# Altium schematic sheet AlarmRelay.SchDoc
size A3; SheetNumber: 6; SheetTotal: 11
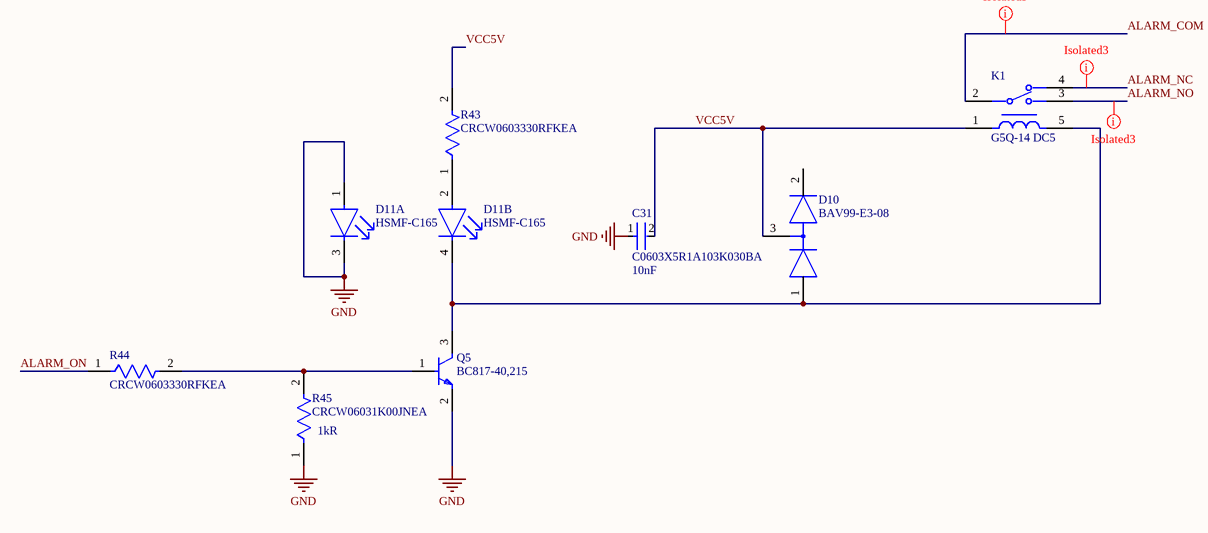
[diagram p0: AlarmRelay.SchDoc]

## Parts
C31  C0603X5R1A103K030BA  Capacitance: 10nF  [FP-C0603-030-0_03-MFG]
D10  BAV99-E3-08  [FP-6_541-5014_01-4-MFG]
D11  HSMF-C165  [FP-HSMF-C165-MFG]  (parts A,B of 2)
K1  G5Q-14 DC5  [FP-G5Q-14_DC5-MFG]
Q5  BC817-40,215  [FP-SOT23-MFG]
R43  CRCW0603330RFKEA  [FP-CRCW0603-e3-MFG]
R44  CRCW0603330RFKEA  [FP-CRCW0603-e3-MFG]
R45  CRCW06031K00JNEA  Resistance: 1kR  [FP-CRCW0603-e3-IPC_C]

## Nets
GND: C31.1 D11.1(GREEN_A) D11.3(GREEN_C) Q5.2(E) R45.1
ALARM_COM: K1.2
ALARM_NC: K1.4
ALARM_NO: K1.3
ALARM_ON: R44.1
VCC5V: C31.2 D10.3 K1.1 R43.2
NetD10_1: D10.1 D11.4(RED_C) K1.5 Q5.3(C)
NetD11_2: D11.2(RED_A) R43.1
NetQ5_1: Q5.1(B) R44.2 R45.2

Not connected (* = marked no-connect by the designer): D10 2

## Layout directives
net class Isolated3: ALARM_COM, ALARM_NC, ALARM_NO

## Library data of the parts
C31 = CMP-08246-002714-1: Multilayer Ceramic Capacitors 10nF ±10% 10V X5R SMD 0201; Dissipation Factor: 5%; Case Code (Imperial): 0201; Tolerance: 10%; Voltage: 10V; Case/Package: 0201; Width: 0.012inch; Series: C; Construction: Flat; Lead Free: Lead Free; Dielectric: X5R; Depth: 0.3mm; Mount: Surface Mount; Number of Pins: 2; Voltage Rating (DC): 10V; Radiation Hardening: No; Length: 0.6mm; Resistor Type: Ceramic; Dielectric Material: Ceramic; Packaging: Tape and Reel; Height: 0.3mm; Package Quantity: 1; RoHS Compliant: Yes; Thickness: 0.013inch; Min Operating Temperature: -55°C; Voltage Rating: 10V; Case Code (Metric): 0603; Weight: 6E-06oz; Max Operating Temperature: 85°C; Termination: SMD/SMT
D10 = CMP-02540-000013-1: DIODE ARRAY GP 70V 150MA SOT23; Manufacturer: Vishay; Max Surge Forward Current: 1A; Value: 1.5pF; Max Junction Temp: +150°C; Automotive Grade: NA; Forward Current: 250mA; Peak Reverse Current: 2.5uA; Digikey Description: DIODE ARRAY GP 70V 150MA SOT23; Device Class L2: Diodes; Category: Diode; Temperature: -55°C to +150°C; Octopart: https://octopart.com/bav99-e3-08-vishay-46456629; Temperature Range Low: -55°C; Package: 6.541-5014.01-4; ComponentLink2Description: Datasheet; RoHS: TRUE; ComponentLink2URL: http://www.vishay.com/docs/85718/bav99.pdf; Ipc Land Pattern Name: SOT95P248X102-3; Height: 1.15mm; Reverse Voltage: 70V; Capacitance: 1.5pF; Automotive: No; Temperature Range High: +150°C; Device Class L1: Discrete Semiconductors; Mouser Description: Diodes - General Purpose, Power, Switching 70V 250mA 4.5A IFSM Dual Series; Manufacturer Part Number: BAV99-E3-08; Lead Free: Yes; Device Class L3: Rectifier Diodes; Max Repetitive Reverse Voltage: 70V
D11 = CMP-2000-06424-2: LED GREEN/RED DIFFUSED 0603 SMD; Reverse Voltage: 5V; Dominant Wavelength: 621nm; Number of Elements: 2; Shape: Rectangular; Luminous Intensity: 10mcd; Forward Current: 20mA; Lens Color: White; Illumination Color: Green; Power Dissipation: 52mW; Wavelength: 572nm; Viewing Angle: 120°; Forward Voltage: 2.2V; Max Operating Temperature: 85°C; Lens Transparency: Diffused; Width: 0.8mm; Case/Package: 0603; Packaging: Tape and Reel; Case Code (Metric): 1608; Depth: 0.8mm; REACH SVHC: No SVHC; Number of LEDs: 2; Radiation Hardening: No; Lens Style: Rectangular; Color: Green; Case Code (Imperial): 0603; Min Operating Temperature: -40°C; Power Rating: 52mW; Number of Pins: 4; Number of Terminals: 4; Package Quantity: 1; Mount: Surface Mount; Height: 0.5mm; Length: 1.6mm; Lead Free: Lead Free; Test Current: 20mA
K1 = CMP-08822-000014-1: RELAY GEN PURPOSE SPDT 10A 5V; Manufacturer: Omron; Coil Type: Non-Latching; Coil Resistance: 63Ω; Number Of Contacts: 1; Coil Power: 400mW; Coil Current: 80mA; Standoff Height: 0.4mm; Device Class L2: Relays; Octopart: https://octopart.com/g5q-14+dc5-omron-71281; RoHS: TRUE; Temperature: -40°C to +105°C; Temperature Range High: +105°C; Category: Relay; ComponentLink2Description: Datasheet; Device Class L1: Electromechanical; Manufacturer Part Number: G5Q-14 DC5; ComponentLink2URL: https://omronfs.omron.com/en_US/ecb/products/pdf/en-g5q.pdf; Height: 16.2mm; Throw Configuration: SPDT; Current Rating: 10A; Mouser Description: Power Relay 5VDC 5(NO)/3(NC)DC/10(NO)/3(NC)AAC SPDT (20.3MM 10.3MM 16.2MM) Tht; Automotive: No; Device Class L3: Power Relays; Lead Free: Yes; Digikey Description: RELAY GEN PURPOSE SPDT 10A 5V; Package: 0; Coil Voltage: 5V; Temperature Range Low: -40°C; Ambient Temperature Range High: +105°C; Ambient Temperature Range Low: -40°C; Switching Current: 10A
Q5 = CMP-14406-000007-1: TRANS NPN 45V 0.5A SOT23; Manufacturer: Nexperia; Collector Emitter Saturation Voltage: 700mV; Power Dissipation: 250mW; Collector Base Voltage: 50V; Unity Gain Freq: 100MHz; Hfe Max: 600; Rthja Max: 500K/W; Emitter Base Voltage: 5V; Max Collector Current: 500mA; Hfe Testvce: 1V; Automotive Grade: Grade 0; Hfe Min: 250; Max Junction Temp: +150°C; Number Of Npn: 1; Hfe Testic: 100mA; Octopart: https://octopart.com/bc817-40%2C215-nexperia-78739081; Lead Free: Yes; Ipc Land Pattern Name: SOT95P230X100-3; Manufacturer Part Number: BC817-40,215; RoHS: TRUE; Collector Emitter Breakdown Voltage: 45V; Digikey Description: TRANS NPN 45V 0.5A SOT23; ComponentLink2URL: https://assets.nexperia.com/documents/data-sheet/BC817_SER.pdf; Temperature Range High: +150°C; Mouser Description: BC817 Series 45 V 500 mA 250 mW SMT NPN General-Purpose Transistor - SOT-23-; Device Class L3: BJTs; Temperature: to +150°C; Height: 1.1mm; Automotive: Yes; Ambient Temperature Range Low: -65°C; Package: SOT23; Collector Emitter Voltage: 45V; Category: Trans; ComponentLink2Description: Datasheet; Device Class L2: Transistors; Ambient Temperature Range High: +150°C; Number Of Elements: 1; Device Class L1: Discrete Semiconductors; Footprint Url: https://assets.nexperia.com/documents/outline-drawing/SOT23.pdf
R43 R44 = CMP-1012-00454-3: RES Thick Film, 330Ω, 1%, 0.1W, 100ppm/°C, 0603; Voltage Rating: 75V; Max Power Dissipation: 100mW; Resistance: 330R; Depth: 0.85mm; Contact Plating: Tin; Package Quantity: 10; Termination: SMD/SMT; Tolerance: 1%; Height: 0.45mm; Number of Terminations: 2; Radiation Hardening: No; Features: Automotive AEC-Q200; Case/Package: 0603; Mount: Surface Mount; Case Code (Metric): 1608; Lead Free: Lead Free; Temperature Coefficient: 100ppm/°C; Weight: 7.1E-05oz; Military Standard: Not; Packaging: Tape and Reel; Max Operating Temperature: 155°C; Voltage Rating (DC): 75V; Length: 1.55mm; Min Operating Temperature: -55°C; Composition: Thick Film; Case Code (Imperial): 0603; Width: 0.033inch; Power Rating: 100mW
R45 = CMP-02407-007100-1: RES Thick Film, 1kΩ, 5%, 0.1W, 200ppm/°C, 0603; Power Rating: 100mW; Voltage Rating: 75V; Height: 0.02inch; Number of Terminations: 2; Radiation Hardening: No; Max Operating Temperature: 155°C; Packaging: Tape and Reel; Package Quantity: 1; Military Standard: Not; Case/Package: 0603; Weight: 7.1E-05oz; Tolerance: 5%; Temperature Coefficient: 200ppm/°C; Termination: SMD/SMT; Case Code (Metric): 1608; Length: 1.55mm; Min Operating Temperature: -55°C; Depth: 0.85mm; Composition: Thick Film; Width: 0.033inch; Number of Pins: 2; Contact Plating: Tin; Max Power Dissipation: 100mW; Voltage Rating (DC): 75V; Case Code (Imperial): 0603; Lead Free: Lead Free; Features: Automotive AEC-Q200